# Altium schematic sheet Peripherals.SchDoc
size A4
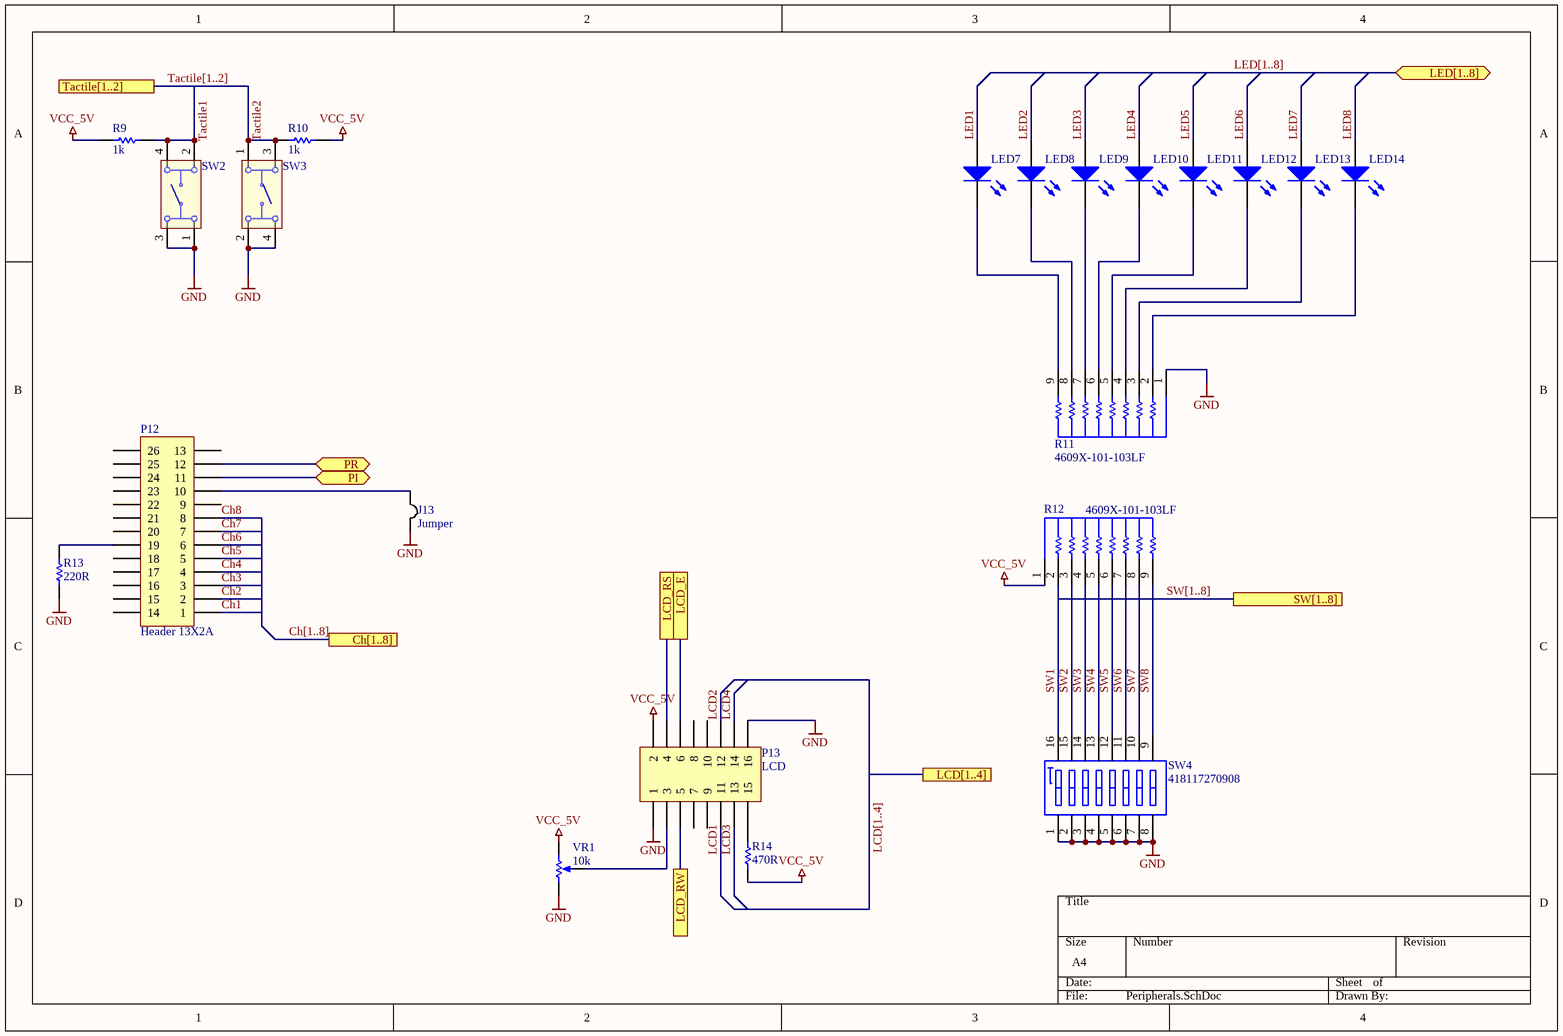
[diagram p0: Peripherals.SchDoc]

## Parts
J13  Jumper  [SMDJumper]
LED7  TX1  [Type 3mm]  (value not drawn)
LED8  TX1  [Type 3mm]  (value not drawn)
LED9  TX1  [Type 3mm]  (value not drawn)
LED10  TX1  [Type 3mm]  (value not drawn)
LED11  TX1  [Type 3mm]  (value not drawn)
LED12  TX1  [Type 3mm]  (value not drawn)
LED13  TX1  [Type 3mm]  (value not drawn)
LED14  TX1  [Type 3mm]  (value not drawn)
P12  Header 13X2A  [HDR2X13_CEN]
P13  LCD  [HDR2X8]
R9  1k  [RESC0805(2012)_M]
R10  1k  [RESC0805(2012)_M]
R11  4609X-101-103LF  [BOUR-4609X]
R12  4609X-101-103LF  [BOUR-4609X]
R13  220R  [RESC0805(2012)_M]
R14  470R  [RESC0805(2012)_M]
SW2  430156130726  [430156130726]  (value not drawn)
SW3  430156130726  [430156130726]  (value not drawn)
SW4  418117270908  [418117270908]
VR1  10k  [BOUR-3362P]

## Ports
Ch[1..8], LCD[1..4], LCD_E, LCD_RS, LCD_RW, LED[1..8] (bidir), PI (bidir), PR (bidir), SW[1..8], Tactile[1..2]

## Nets
GND: J13.2 P13.1 P13.16 R11.1 R13.1 SW2.1 SW2.3 SW3.2 SW3.4 SW4.1 SW4.2 SW4.3 SW4.4 SW4.5 SW4.6 SW4.7 SW4.8 VR1.1(CCW)
VCC_5V: P13.2 R9.2 R10.1 R12.1 R14.1 VR1.3(CW)
Ch1: P12.1
Ch2: P12.2
Ch3: P12.3
Ch4: P12.4
Ch5: P12.5
Ch6: P12.6
Ch7: P12.7
Ch8: P12.8
LCD1: P13.11
LCD2: P13.12
LCD3: P13.13
LCD4: P13.14
LCD_E: P13.6 ; port LCD_E
LCD_RS: P13.4 ; port LCD_RS
LCD_RW: P13.5 ; port LCD_RW
LED1: LED7.2(A)
LED2: LED8.2(A)
LED3: LED9.2(A)
LED4: LED10.2(A)
LED5: LED11.2(A)
LED6: LED12.2(A)
LED7: LED13.2(A)
LED8: LED14.2(A)
PI: P12.11 ; port PI
PR: P12.12 ; port PR
SW1: R12.2 SW4.16
SW2: R12.3 SW4.15
SW3: R12.4 SW4.14
SW4: R12.5 SW4.13
SW5: R12.6 SW4.12
SW6: R12.7 SW4.11
SW7: R12.8 SW4.10
SW8: R12.9 SW4.9
Tactile1: R9.1 SW2.2 SW2.4
Tactile2: R10.2 SW3.1 SW3.3
NetJ13_1: J13.1 P12.10
NetLED7_1: LED7.1(K) R11.9
NetLED8_1: LED8.1(K) R11.8
NetLED9_1: LED9.1(K) R11.7
NetLED10_1: LED10.1(K) R11.6
NetLED11_1: LED11.1(K) R11.5
NetLED12_1: LED12.1(K) R11.4
NetLED13_1: LED13.1(K) R11.3
NetLED14_1: LED14.1(K) R11.2
NetP12_19: P12.19 R13.2
NetP13_3: P13.3 VR1.2(S)
NetP13_15: P13.15 R14.2

Not connected (* = marked no-connect by the designer): P12 9 13 14 15 16 17 18 20 21 22 23 24 25 26; P13 7 8 9 10

## Buses and harness runs
bus Ch[1..8] = port Ch[1..8]
bus LCD[1..4] = port LCD[1..4]
bus LED[1..8] = port LED[1..8]
bus SW[1..8] = port SW[1..8]
bus Tactile[1..2] = port Tactile[1..2]

## Library data of the parts
LED7-LED14 = CMP-1489-00003-1: THT LED round mono-color waterclear, WL-TMRW, Yellow; Manufacturer: Wuerth Elektronik; PartNumber: 151033YS03000; ComponentLink2Description: Datasheet; ComponentLink1Description: Manufacturer URL; Emitting color: Yellow; ComponentLink2URL: http://katalog.we-online.de/pbs/datasheet/7448042001.pdfhttp://katalog.we-online.de/pbs/datasheet/7448042001.pdfhttp://katalog.we-online.de/pbs/datasheet/7448042001.pdfhttp://katalog.we-online.de/pbs/datasheet/151033YS03000.pdf; ComponentLink1URL: http://www.we-online.com; PackageReference: Type 3mm
P12 = Header 13X2A: Header, 13-Pin, Dual row; LatestRevisionDate: 17-Jul-2002; LatestRevisionNote: Re-released for DXP Platform.; Publisher: Altium Limited
P13 = Header 8X2: Header, 8-Pin, Dual row; LatestRevisionDate: 17-Jul-2002; LatestRevisionNote: Re-released for DXP Platform.; Publisher: Altium Limited
R9 R10 = CMP-1013-00473-1: 1k 0.125W 1% 0805 (2012 Metric)  SMD; Case-Metric: 2012; Case-EIA: 0805; Power: 0.125 W; Value: 1k; Technology: SMT; Tolerance: 1 %
R11 R12 = CMP-2000-05605-1: Resistor, Network, 1.13 W, 10 kOhm, -55 to 125 degC, 9-Pin THD, RoHS, Bulk; Manufacturer: Bourns; Tolerance: ±2%; Power, Rating: 1.13W; Resistance: 10kilohms; Temperature, Operating: -55to+125°C; Brand/Series: 4600XSeries; Circuit: BussedArray; Number of Resistors: 8; Package Type: SIP; Dimensions: 0.898x0.098x0.2(22.81x2.49x5.08)LxWxHin.(mm); Package Reference: 4609X; Mounting Technology: ThroughHole; Package Description: 9-Pin Through Hole Device, Body 22.81 x 2.49 mm, Pitch 2.54 mm; Number of Terminals: 9; Datasheet URL: https://datasheet.ciiva.com/11807/0900766b8069ccfd-11807021.pdf; Datasheet Version: 04/2010; Manufacturer URL: http://www.bourns.com/; Mounting Type: ThroughHole
R13 = CMP-1013-00473-1: 220R 0.125W 1% 0805 (2012 Metric)  SMD; Case-Metric: 2012; Case-EIA: 0805; Power: 0.125 W; Value: 220R; Technology: SMT; Tolerance: 1 %
R14 = CMP-1013-00473-1: 470R 0.125W 1% 0805 (2012 Metric)  SMD; Case-Metric: 2012; Value: 470.00 Ohm; Case-EIA: 0805; Power: 0.125 W; Technology: SMT; Tolerance: 1 %
SW2 SW3 = CMP-1453-00009-1: WS-TATV THT Tact Switch 6X6 mm; Manufacturer: Wuerth Elektronik; NoPins: 04; PartNumber: 430156130726; ComponentLink1Description: Manufacturer URL; ComponentLink1URL: http://www.we-online.com; ComponentLink2Description: Datasheet; ComponentLink2URL: http://katalog.we-online.de/em/datasheet/4301x6.pdf; PackageReference: 430156130726
SW4 = CMP-1435-00007-1: WS-DITV 2.54 mm Compact THT Dip Switch with Raised Actuator; Manufacturer: Wuerth Elektronik; NoPins: 16; ComponentLink2URL: http://katalog.we-online.de/em/datasheet/4181172709xx.pdf; ComponentLink1Description: Manufacturer URL; ComponentLink1URL: http://www.we-online.com; ComponentLink2Description: Datasheet; PackageReference: 418117270908; PartNumber: 418117270908
VR1 = CMP-1747-00003-1: Square Trimpot(R) Trimming Potentiometer, 100 KOhm, 300 V, -55 to 125 degC, 3-Pin THD, RoHS, Tube; Voltage Rating: 250 V; Case\Package: Axial; Tolerance: 1%; Power Rating: 250 mW; Resistance: 1 mohm; RoHSCompliant: true; ComponentLink2URL: http://www.bourns.com/docs/Product-Datasheets/3362.pdf; ComponentLink1Description: Manufacturer URL; DatasheetVersion: May-16; Package Quantity: 200; ComponentLink2Description: Datasheet; Min Operating Temperature: -55 degC; Mount: Through Hole; PackageDescription: 3-Pin Through Hole Device, Body 6.6 x 6.99 mm, Pitch 2.54 mm; Length: 0.248 inch; ComponentLink1URL: http://www.bourns.com/; PackageReference: 3326P; Max Operating Temperature: 155 degC; Packaging: Bulk